# Altium project Multivibrator_Full.PrjPcb
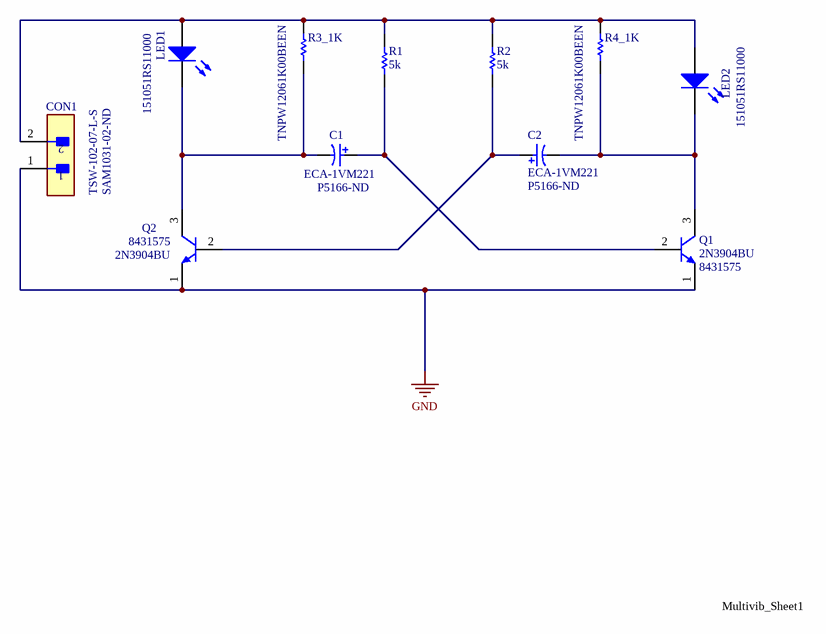
[diagram p0: Multivib_Sheet1.SchDoc]
1 sheet, 11 parts. Net scope: global (net labels, ports and power ports of the same name join across sheets).
Board file: Multivib_Sheet1.PcbDoc

## Sheet Multivib_Sheet1.SchDoc: Multivib_Sheet1
size A4; SheetNumber: 1

### Parts
C1  ECA-1VM221  Supplier Part Number 1: P5166-ND  [PNSC-ECA-1VM221-2]
C2  ECA-1VM221  Supplier Part Number 1: P5166-ND  [PNSC-ECA-1VM221-2]
CON1  TSW-102-07-L-S  Supplier Part Number 1: SAM1031-02-ND  [FP-TSW-102-07-L-S-MFG]
LED1  151051RS11000  [Type 5mm]
LED2  151051RS11000  [Type 5mm]
Q1  2N3904BU  Supplier Part Number 1: 8431575  [FAIR-TO-92]
Q2  2N3904BU  Supplier Part Number 1: 8431575  [FAIR-TO-92]
R1  5k  [RESC2013X50X30ML20T20]
R2  5k  [RESC2013X50X30ML20T20]
R3_1K  Supplier Part Number 1: TNPW12061K00BEEN  [RESC3216X65X50ML15T25]
R4_1K  Supplier Part Number 1: TNPW12061K00BEEN  [RESC3216X65X50ML15T25]

### Nets
GND: CON1.1 Q1.1(E) Q2.1(E)
NetC1_1: C1.1 Q1.2(B) R1.1
NetC1_2: C1.2 LED1.1(K) Q2.3(C) R3_1K.1
NetC2_1: C2.1 Q2.2(B) R2.1
NetC2_2: C2.2 LED2.1(K) Q1.3(C) R4_1K.1
NetCON1_2: CON1.2 LED1.2(A) LED2.2(A) R1.2 R2.2 R3_1K.2 R4_1K.2

### Notes on the sheet
- Multivib_Sheet1

### Library data of the parts
C1 C2 = CMP-2000-05311-1: Aluminum Electrolytic Capacitor, 220 uF, +/- 20%, 35 V, -40 to 85 degC, 2-Pin THD, RoHS, Bulk; Manufacturer: Panasonic; Manufacturer Part Number 1: ECA1VM221; Lifetime@Temperature: 2000Hrs@85degC; Rated Voltage: 35V; Ripple Current: 350mA; Type: Radial; Capacitance: 220µF; Dielectric Material: Aluminium; Leakage Current: 3uA; Life (Hours): 2000Hour; Dissipation Factor: 0.14%; Polarity: Polar; Lead/Base Style: Straight; Lead Diameter: 0.6mm; Package Reference: ECA-1VM221; Series: M; Operating Temp Range: -40to+85degC; Package Description: 2-Pin Axial Lead, Dia 8 mm, Body Length 12.5 mm; Datasheet Version: Mar-06; Datasheet URL: https://datasheet.ciiva.com/26341/441851-da-01-en-elko-eca1vm221-m-r-220myf-35v-85c-26341906.pdf; Operating Temp-Max: 85degC; Case Size/Dimension: Ø8x11.5mm; Manufacturer URL: http://www.panasonic.com/; Supplier 1: Digi-Key; Manufacturer 1: Panasonic; RoHS: Yes; Category: Aluminum Electrolytic Capacitors; Stock 1: 390; Pricing 1: 1=0.43000, 10=0.29600, 50=0.20700, 100=0.17740, 500=0.13304, 1000=0.11234, 2500=0.10642, 5000=0.10051 (USD); Mount: Through Hole,PCB; Case/Package: Radial; Number of Pins: 2; Contact Plating: Tin; Min Operating Temperature: -40°C; Max Operating Temperature: 85°C; Tolerance: 20%; Packaging: Bulk; Voltage Rating: 35V; Package Quantity: 200; Voltage Rating (DC): 35V; Termination: Radial; Voltage: 35V; Construction: RADIAL; Ripple Current (AC): 350mA; Diameter: 8mm; Length: 11.5mm; Height: 11.5mm; Height - Seated (Max): 0.492inch; Lead Pitch: 3.5mm; Radiation Hardening: No; REACH SVHC: No SVHC; RoHS Compliant: Yes; Lead Free: Lead Free; ComponentLink1URL: https://datasheet.ciiva.com/11777/0900766b800274c2-11777872.pdf?src-supplier=RSComponents; ComponentLink1Description: https://datasheet.ciiva.com/11777/0900766b800274c2-11777872.pdf?src-supplier=RSComponents; ComponentLink2URL: https://datasheet.ciiva.com/26341/441851-da-01-en-elko-eca1vm221-m-r-220myf-35v-85c-26341906.pdf?src-supplier=Conrad; ComponentLink2Description: https://datasheet.ciiva.com/26341/441851-da-01-en-elko-eca1vm221-m-r-220myf-35v-85c-26341906.pdf?src-supplier=Conrad; ComponentLink3URL: https://datasheet.ciiva.com/24023/aba0000ce12-465472-24023260.pdf?src-supplier=Mouser; ComponentLink3Description: https://datasheet.ciiva.com/24023/aba0000ce12-465472-24023260.pdf?src-supplier=Mouser; ComponentLink4URL: https://datasheet.ciiva.com/14590/70067785-14590042.pdf?src-supplier=Allied+Electronics; ComponentLink4Description: https://datasheet.ciiva.com/14590/70067785-14590042.pdf?src-supplier=Allied+Electronics; ComponentLink5URL: https://datasheet.ciiva.com/14601/70067785-14601242.pdf?src-supplier=Allied+Electronics; ComponentLink5Description: https://datasheet.ciiva.com/14601/70067785-14601242.pdf?src-supplier=Allied+Electronics; ComponentLink6URL: https://datasheet.ciiva.com/43485/aba0000ce12-43485334.pdf?src-supplier=Farnell; ComponentLink6Description: https://datasheet.ciiva.com/43485/aba0000ce12-43485334.pdf?src-supplier=Farnell; ComponentLink7URL: https://datasheet.ciiva.com/46387/1907780-46387398.pdf?src-supplier=Element14; ComponentLink7Description: https://datasheet.ciiva.com/46387/1907780-46387398.pdf?src-supplier=Element14; ComponentLink8URL: https://datasheet.ciiva.com/2983/aba0000ce12-2983864.pdf?src-supplier=Avnet; ComponentLink8Description: https://datasheet.ciiva.com/2983/aba0000ce12-2983864.pdf?src-supplier=Avnet; ComponentLink9URL: https://datasheet.ciiva.com/16426/aba0000ce12-16426383.pdf?src-supplier=Future+Electronics; ComponentLink9Description: https://datasheet.ciiva.com/16426/aba0000ce12-16426383.pdf?src-supplier=Future+Electronics; ComponentLink10URL: https://datasheet.ciiva.com/15166/getdatasheetpartid-178468-15166214.pdf?src-supplier=Verical; ComponentLink10Description: https://datasheet.ciiva.com/15166/getdatasheetpartid-178468-15166214.pdf?src-supplier=Verical; ComponentLink11URL: https://datasheet.ciiva.com/17356/aba0000ce12-17356350.pdf?src-supplier=Avnet+Europe; ComponentLink11Description: https://datasheet.ciiva.com/17356/aba0000ce12-17356350.pdf?src-supplier=Avnet+Europe
CON1 = CMP-02766-001428-1: CONN HEADER VERT 2POS 2.54MM; Manufacturer 1: Samtec; Voltage Rating: 550V; Current Rating: 7.6A; Gender: Male; Number of Contacts: 2; Connector Type: Male Pin; Radiation Hardening: No; Orientation: Straight; Contact Plating: Gold; Max Operating Temperature: 125°C; Mount: Through Hole; Package Quantity: 1; Number of Rows: 1; Housing Material: Polyester; RoHS Compliant: Yes; Length: 5.08mm; Max Voltage Rating (AC): 550V; Pitch: 2.54mm; Packaging: Bulk; Depth: 2.54mm; Termination: Solder; Min Operating Temperature: -55°C; Housing Color: Black; Lead Free: Lead Free; Color: Black; Number of Positions: 2; Width: 2.54mm; Max Current Rating: 7.6A; REACH SVHC: No SVHC; Contact Material: Bronze; Contact Mating Length: 0.23inch; Series: TSW; Contact Type: Male Pin; Supplier 1: Digi-Key; Manufacturer Part Number 1: TSW-102-07-L-S; RoHS: Yes; Category: Connectors; Stock 1: 9026; Pricing 1: 1=0.25000, 10=0.23200, 25=0.19800, 50=0.17340, 100=0.16100, 250=0.14240, 500=0.13622 (USD); ComponentLink1URL: https://datasheet.ciiva.com/25616/0900766b81154476-25616838.pdf?src-supplier=RSComponents; ComponentLink1Description: https://datasheet.ciiva.com/25616/0900766b81154476-25616838.pdf?src-supplier=RSComponents; ComponentLink2URL: https://datasheet.ciiva.com/10281/htsw-th-10281275.pdf?src-supplier=Avnet; ComponentLink2Description: https://datasheet.ciiva.com/10281/htsw-th-10281275.pdf?src-supplier=Avnet; ComponentLink3URL: https://datasheet.ciiva.com/16734/htsw-th-16734221.pdf?src-supplier=Avnet+Europe; ComponentLink3Description: https://datasheet.ciiva.com/16734/htsw-th-16734221.pdf?src-supplier=Avnet+Europe; ComponentLink4URL: https://datasheet.ciiva.com/6889/tsw-xxx-xx-xxx-x-xx-xxx-mkt-6889246.pdf?src-supplier=Digi-Key; ComponentLink4Description: https://datasheet.ciiva.com/6889/tsw-xxx-xx-xxx-x-xx-xxx-mkt-6889246.pdf?src-supplier=Digi-Key; ComponentLink5URL: https://datasheet.ciiva.com/22677/1596380-22677790.pdf?src-supplier=Element14; ComponentLink5Description: https://datasheet.ciiva.com/22677/1596380-22677790.pdf?src-supplier=Element14
LED1 LED2 = CMP-1488-00008-1: THT LED round mono-color color lens, WL-TMRW, Red; Manufacturer: Wuerth Elektronik; PackageReference: Type 5mm; PartNumber: 151051RS11000; ComponentLink2URL: http://katalog.we-online.de/pbs/datasheet/7448042001.pdfhttp://katalog.we-online.de/pbs/datasheet/7448042001.pdfhttp://katalog.we-online.de/pbs/datasheet/7448042001.pdfhttp://katalog.we-online.de/pbs/datasheet/151051RS11000.pdf; ComponentLink1URL: http://www.we-online.com; ComponentLink1Description: Manufacturer URL; ComponentLink2Description: Datasheet; Emitting color: Red
Q1 Q2 = CMP-2000-04944-1: NPN General-Purpose Amplifier, 40 V VCEO, 0.2 A, -55 to 150 degC, 2-Pin TO-92, RoHS, Bulk; Manufacturer: FairchildSemiconductor; Manufacturer 1: ON Semiconductor / Fairchild; Maximum Collector Base Voltage: 60V; Minimum DC Current Gain: 40@0.1mA@1V; Maximum Collector Emitter Voltage: 40V; Maximum DC Collector Current: 0.2A; Rad Hard: No; Maximum Operating Frequency: 300(Min)MHz; Maximum Collector Emitter Saturation Voltage: 0.2@1mA@10mA; Maximum Power Dissipation: 625mW; Max Collector Current: 200mA; Emitter Base Voltage (VEBO): 6V; Element Configuration: Single; Transition Frequency: 300MHz; hFE Min: 100; Collector Emitter Saturation Voltage: 300mV; Number of Elements: 1; Package Description: 3-Pin Transistor Outline Package, Body Dia 4.79 mm, Pitch 1.27 mm; Package Reference: TO-92; Pin Count: 3; Operating Temperature: -55to150degC; Category: GPBJT; Manufacturer URL: https://www.fairchildsemi.com/; Datasheet URL: https://datasheet.ciiva.com/4722/2n3904-82270-4722369.pdf; Package: 3TO-92; Packaging: Bulk; Type: NPN; Datasheet Version: Rev. 1.1.0, 10/2014; Mounting: ThroughHole; Supplier 1: RSComponents; Manufacturer Part Number 1: 2N3904BU; RoHS: Yes; Stock 1: 1200; Pricing 1: 50=0.24800, 2500=0.17900 (GBP); Mount: Through Hole; Case/Package: TO-92; Number of Pins: 3; Weight: 0.179g; Min Operating Temperature: -55°C; Max Operating Temperature: 150°C; Max Power Dissipation: 625mW; Collector Emitter Voltage (VCEO): 40V; Polarity: NPN; Collector Emitter Breakdown Voltage: 40V; Collector Base Voltage (VCBO): 60V; Package Quantity: 1000; Power Dissipation: 625mW; Voltage Rating (DC): 60V; Current Rating: 200mA; Gain Bandwidth Product: 300MHz; Frequency: 300MHz; Max Frequency: 300MHz; Length: 5.2mm; Width: 4.19mm; Height: 5.33mm; Radiation Hardening: No; REACH SVHC: No SVHC; Lead Free: Lead Free; RoHS Compliant: Yes; ComponentLink1URL: https://datasheet.ciiva.com/15139/getdatasheetpartid-185752-15139727.pdf?src-supplier=Verical; ComponentLink1Description: https://datasheet.ciiva.com/15139/getdatasheetpartid-185752-15139727.pdf?src-supplier=Verical; ComponentLink2URL: https://datasheet.ciiva.com/19459/783421-19459422.pdf?src-supplier=Jameco; ComponentLink2Description: https://datasheet.ciiva.com/19459/783421-19459422.pdf?src-supplier=Jameco; ComponentLink3URL: https://datasheet.ciiva.com/26229/mmbt3904-26229800.pdf?src-supplier=Avnet+Europe; ComponentLink3Description: https://datasheet.ciiva.com/26229/mmbt3904-26229800.pdf?src-supplier=Avnet+Europe; ComponentLink4URL: https://datasheet.ciiva.com/972/mmbt3904-972165.pdf?src-supplier=Digi-Key; ComponentLink4Description: https://datasheet.ciiva.com/972/mmbt3904-972165.pdf?src-supplier=Digi-Key
R1 R2 = CMP-2001-04239-1: Res Thick Film 0805 5K Ohm 1% 1/8W ±100ppm/°C Molded SMD SMD Paper T/R; Part Number: CRCW08055K00FKTA; Manufacturer: Vishay Dale
R3_1K R4_1K = CMP-2003-04643-1: Manufacturer: Vishay Dale; Resistance: 1kR; Temperature Coefficient: 25ppm/°C; Tolerance: 0.1%; Voltage Rating: 200V; Max Power Dissipation: 250mW; Part Number: TNPW12061K00BEEN; Supplier 1: Avnet; Manufacturer 1: Vishay Dale; Manufacturer Part Number 1: TNPW12061K00BEEN; RoHS: Yes; Category: Chip SMD Resistors; Stock 1: 3000; Pricing 1: 1000=0.21049 (USD); Case/Package: 1206; Number of Pins: 2; Case Code (Imperial): 1206; Case Code (Metric): 3216; Contact Plating: Tin; Size Code: 1206; Min Operating Temperature: -55°C; Max Operating Temperature: 125°C; Packaging: Tape and Reel; Resistor Type: Thin Film; Number of Terminations: 2; Power Rating: 250mW; Series: TNPW; Package Quantity: 1000; Termination: SMD/SMT; Voltage Rating (DC): 200V; Resistance Tolerance: 0.1%; Features: Moisture Resistant,Automotive AEC-Q200,Anti-Sulfur; Construction: Rectangular; Length: 0.126inch; Width: 0.063inch; Height: 0.026inch; Depth: 1.6mm; Radiation Hardening: No; RoHS Compliant: Yes; Lead Free: Lead Free; REACH SVHC: Unknown; Military Standard: Not; ComponentLink1URL: https://datasheet.ciiva.com/16383/tnpw-e3-16383541.pdf?src-supplier=Future+Electronics; ComponentLink1Description: https://datasheet.ciiva.com/16383/tnpw-e3-16383541.pdf?src-supplier=Future+Electronics; ComponentLink2URL: https://datasheet.ciiva.com/9112/tnpw-e3-9112166.pdf?src-supplier=Avnet; ComponentLink2Description: https://datasheet.ciiva.com/9112/tnpw-e3-9112166.pdf?src-supplier=Avnet; ComponentLink3URL: https://datasheet.ciiva.com/2613/tnpw-e3-2613406.pdf?src-supplier=Digi-Key; ComponentLink3Description: https://datasheet.ciiva.com/2613/tnpw-e3-2613406.pdf?src-supplier=Digi-Key